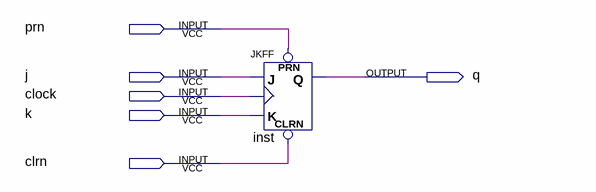
[diagram p0: schematic sheet]
// Quartus schematic mytest2.bdf as structural Verilog: 1 symbols, 6 pins
module mytest2 (
  input  prn,
  input  j,
  input  clock,
  input  k,
  input  clrn,
  output q
);

  JKFF inst (.PRN(prn), .CLRN(clrn), .K(k), .J(j), .CLK(clock), .Q(q));
endmodule
